# EAGLE design M_D_ext_power_old (EAGLE 9.6.2)
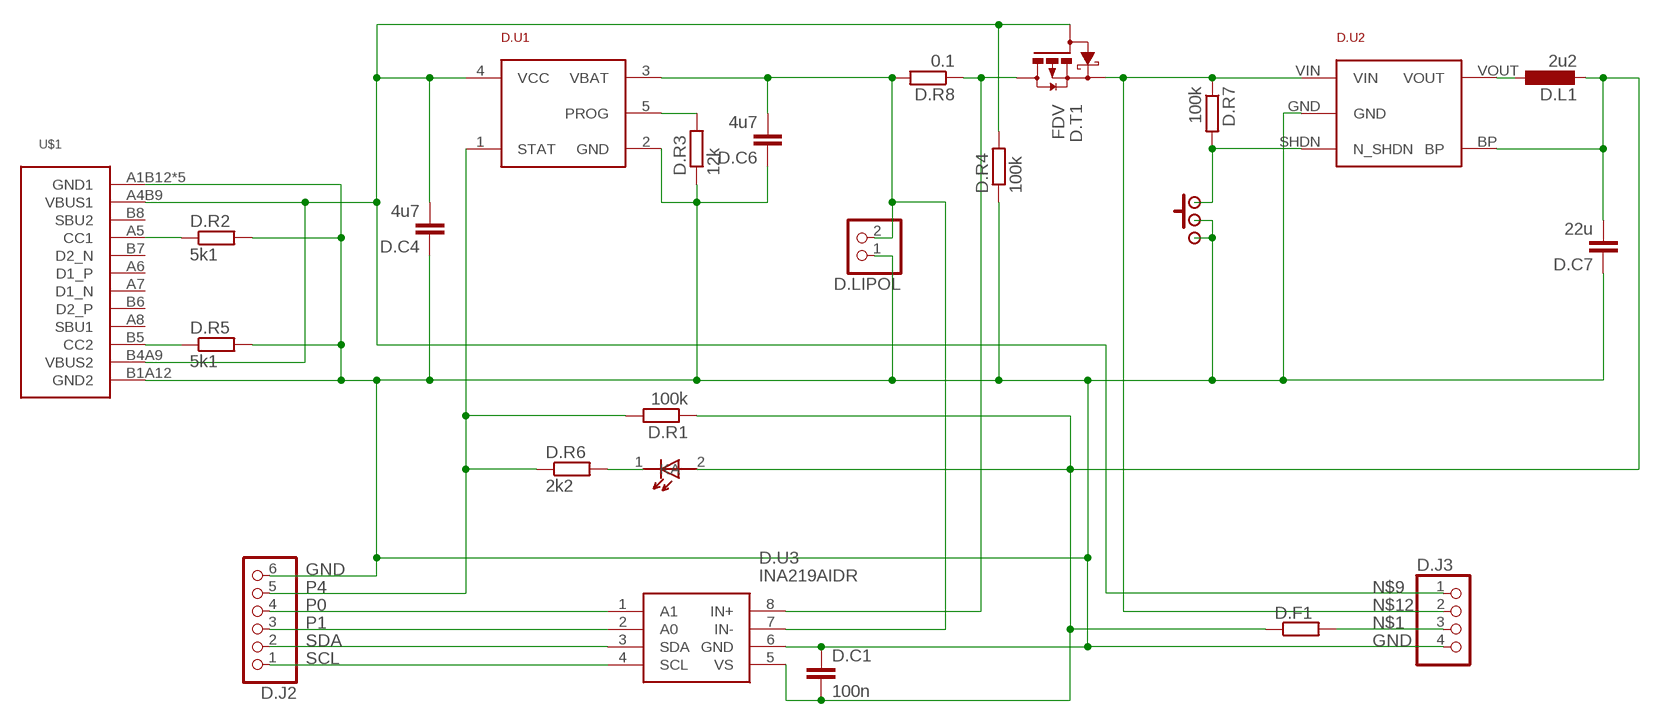
[diagram p0: schematic, sheet 1]

## Parts
D.C1  100n  C-EUC0603  [C0603]
D.C4  4u7  C-EUC0603  [C0603]
D.C6  4u7  C-EUC0603  [C0603]
D.C7  22u  C-EUC0805  [C0805]
D.D1  LED_1.8  [LED_1.8]
D.F1  R-EU_R0805  [R0805]
D.J2  PINHD-1X6  [1X06]
D.J3  PINHD-1X4  [1X04]
D.L1  2u2  L-EUL3230M  [L3230M]
D.LIPOL  PINHD-1X2  [1X02]
D.ON/OFF/RESET  SWITCH  [SWITCH]
D.R1  100k  R-EU_R0603  [R0603]
D.R2  5k1  R-EU_R0603  [R0603]
D.R3  12k  R-EU_R0603  [R0603]
D.R4  100k  R-EU_R0603  [R0603]
D.R5  5k1  R-EU_R0603  [R0603]
D.R6  2k2  R-EU_R0603  [R0603]
D.R7  100k  R-EU_R0603  [R0603]
D.R8  0.1  R-EU_R0805  [R0805]
D.T1  FDV  P-MOSFET-FDV304P  [SOT23]
D.U1  MCP  MCP73831  [SOT23-5]
D.U2  LM3671_3.3  STABILISER_APE8865  [SOT32-5]
D.U3  INA219AIDR  [SOIC127P600X175-8N]
U$1  USB-C  [USB-C]

## Nets
GND: D.C1.1 D.C4.1 D.C6.1 D.C7.1 D.J2.6 D.J3.4 D.LIPOL.1 D.ON/OFF/RESET.P$2 D.ON/OFF/RESET.P$3 D.ON/OFF/RESET.P$5 D.R2.2 D.R3.1 D.R4.1 D.R5.2 D.U1.2(GND) D.U2.GND D.U3.6(GND) U$1.A1B12(GND1) U$1.B1A12(GND2) U$1.SH1(GND1) U$1.SH2(GND1) U$1.SH3(GND1) U$1.SH4(GND1)
N$1: D.F1.2 D.J3.3
N$2: D.L1.1 D.U2.VOUT
N$3: D.D1.1(K) D.R6.2
N$4: D.R5.1 U$1.B5(CC2)
N$5: D.ON/OFF/RESET.P$1 D.ON/OFF/RESET.P$4 D.R7.2 D.U2.SHDN(N_SHDN)
N$6: D.R2.1 U$1.A5(CC1)
N$8: D.R8.1 D.T1.D D.U3.8(IN+)
N$9: D.C4.2 D.J3.1 D.R4.2 D.T1.G D.U1.4(VCC) U$1.A4B9(VBUS1) U$1.B4A9(VBUS2)
N$11: D.R3.2 D.U1.5(PROG)
N$12: D.J3.2 D.R7.1 D.T1.S D.U2.VIN
N$13: D.C6.2 D.LIPOL.2 D.R8.2 D.U1.3(VBAT) D.U3.7(IN-)
P0: D.J2.4 D.U3.1(A1)
P1: D.J2.3 D.U3.2(A0)
P4: D.J2.5 D.R1.2 D.R6.1 D.U1.1(STAT)
SCL: D.J2.1 D.U3.4(SCL)
SDA: D.J2.2 D.U3.3(SDA)
VDD: D.C1.2 D.C7.2 D.D1.2(A) D.F1.1 D.L1.2 D.R1.1 D.U2.BP D.U3.5(VS)
Unconnected: U$1.A6(D1_P) U$1.A7(D1_N) U$1.A8(SBU1) U$1.B6(D2_P) U$1.B7(D2_N) U$1.B8(SBU2)

## Library data of the parts
D.C1 D.C4 D.C6 D.C7 = rcl:C-EU: CAPACITOR, European symbol; SPICEPREFIX: C
D.D1 = hugo:LED_1.8
D.F1 D.R1-D.R8 = rcl:R-EU_: RESISTOR, European symbol; SPICEPREFIX: R
D.J2 = pinhead2:PINHD-1X6: PIN HEADER
D.J3 = pinhead2:PINHD-1X4: PIN HEADER
D.L1 = rcl:L-EU: INDUCTOR, European symbol; SPICEPREFIX: L
D.LIPOL = pinhead2:PINHD-1X2: PIN HEADER
D.ON/OFF/RESET = hugo:SWITCH
D.T1 = !stavebnice03:P-MOSFET-FDV304P
D.U1 = !stavebnice03:MCP73831
D.U2 = !stavebnice03:STABILISER_APE8865
D.U3 = SamacSys_Parts:INA219AIDR: 26-V, Bidirectional, Zero-Drift, High-Side, I2C Out Current/Power Monitor Source: Datasheet <http://www.ti.com/lit/gpn/ina219>; DESCRIPTION: 26-V, Bidirectional, Zero-Drift, High-Side, I2C Out Current/Power Monitor; HEIGHT: 1.75mm; MANUFACTURER_NAME: Texas Instruments; MANUFACTURER_PART_NUMBER: INA219AIDR; MOUSER_PART_NUMBER: 595-INA219AIDR; MOUSER_PRICE-STOCK: https://www.mouser.co.uk/ProductDetail/Texas-Instruments/INA219AIDR?qs=XGzIaZb%2FFYIE5YcOHTnKDA%3D%3D
U$1 = hugo:USB-C

## Board
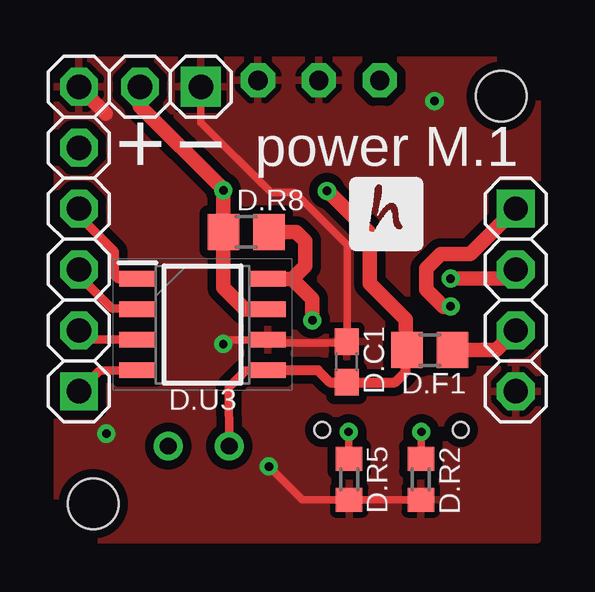
[diagram p1: board, top side]
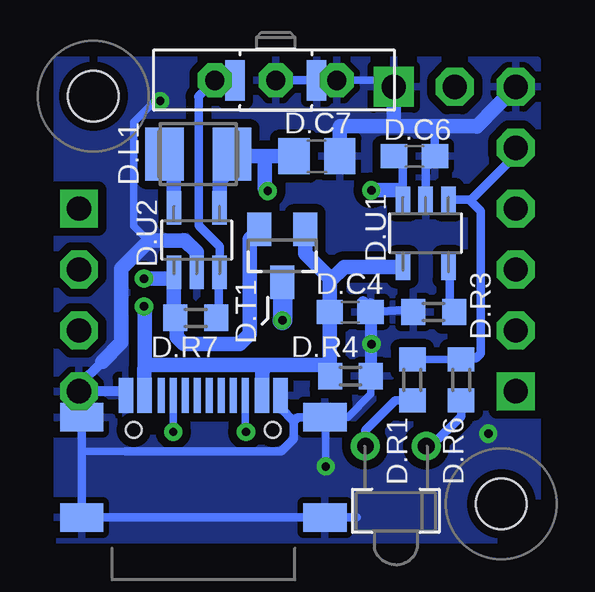
[diagram p2: board, bottom side, seen from below]

No outline drawn. Coordinates in mm, seen from the top.
Copper layers (1*16): Top 0.035mm / dielectric 1.5mm / Bottom 0.035mm
Design rules "default *": minimum track width 10mil, minimum drill 0.35mm, track to track 6mil, track to pad 6mil, pad to pad 6mil, via to via 10mil, smd to smd 10mil, copper to edge 15mil, drill to drill 15mil, minimum pad ring 10mil, minimum via ring 8mil, stop-mask expansion 4mil, vias tented up to drill 0mil, thermal gap 10mil
Holes 2.1 mm at 2,2 19,19

### Footprints (pad centres in the part's own frame; a part is rotated, then mirrored left to right if it is on the bottom)
C0603 = smd 1.1 x 1: 1 -0.85,0; 2 0.85,0
C0805 = smd 1.3 x 1.5: 1 -0.95,0; 2 0.95,0
LED_1.8 = drill 0.7: 1 -1.27,-0.4; 2 1.27,-0.4
R0805 = smd 1.3 x 1.5: 1 -0.95,0; 2 0.95,0
1X06 = drill 1.016 pad 1.575 square: 1 -6.35,0 | drill 1.016 pad 1.575 octagon: 2 -3.81,0; 3 -1.27,0; 4 1.27,0; 5 3.81,0; 6 6.35,0
1X04 = drill 1.016 pad 1.575 square: 1 -3.81,0 | drill 1.016 pad 1.575 octagon: 2 -1.27,0; 3 1.27,0; 4 3.81,0
L3230M = smd 1.6 x 2.2: 1 -1.4,0; 2 1.4,0
1X02 = drill 1.016 pad 1.676 square: 1 -1.27,0 | drill 1.016 pad 1.575 octagon: 2 1.27,0
SWITCH = drill 0.8 pad 1.422 octagon: P$1 -2.54,0; P$2 0,0; P$3 2.54,0 | smd 0.8 x 1.7: P$4 -1.7,0; P$5 1.7,0
R0603 = smd 1 x 1.1: 1 -0.85,0; 2 0.85,0
SOT23 = smd 1 x 1.4: D 0,1.1; G -0.95,-1.1; S 0.95,-1.1
SOT23-5 = smd 0.6 x 1.1: 1 -0.95,-1.45; 2 0,-1.45; 3 0.95,-1.45; 4 0.95,1.35; 5 -0.95,1.35
SOT32-5 = smd 0.6 x 1.4: BP 0.95,1.35; GND 0,-1.35; SHDN 0.95,-1.35; VIN -0.95,-1.35; VOUT -0.95,1.35
SOIC127P600X175-8N = smd 1.528 x 0.65: 1 -2.711,1.905; 2 -2.711,0.635; 3 -2.711,-0.635; 4 -2.711,-1.905; 5 2.711,-1.905; 6 2.711,-0.635; 7 2.711,0.635; 8 2.711,1.905
USB-C = smd 0.6 x 1.45: A1B12 -3.235,3.825; A4B9 -2.46,3.825; B1A12 3.215,3.825; B4A9 2.44,3.825 | smd 0.3 x 1.45: A5 -1.26,3.825; A6 -0.26,3.825; A7 0.24,3.825; A8 1.24,3.825; B5 1.74,3.825; B6 0.74,3.825; B7 -0.76,3.825; B8 -1.76,3.825 | smd 1.8 x 1.2: SH1 -5.08,2.91; SH2 -5.08,-1.27; SH3 5.06,-1.27; SH4 5.06,2.91 | hole 0.65: 2.88,2.38; -2.9,2.38

### Placement (x,y rotation side)
D.C1  12.55,7.92 270 top
D.C4  8.3,10 180 bottom
D.C6  5.62,16.49 180 bottom
D.C7  9.69,16.49 180 bottom
D.D1  6.4,4.01 180 bottom
D.F1  16.02,8.41 0 top
D.J2  1.4,13.04 90 top
D.J3  19.6,10.5 270 top
D.L1  14.63,16.59 0 bottom
D.LIPOL  5.21,19.39 180 top
D.ON/OFF/RESET  11.4,19.66 0 bottom
D.R1  5.71,7.17 90 bottom
D.R2  15.65,3.02 270 top
D.R3  4.82,10 0 bottom
D.R4  8.28,7.32 180 bottom
D.R5  12.66,3.02 270 top
D.R6  3.68,7.16 270 bottom
D.R7  14.73,9.75 0 bottom
D.R8  8.37,13.34 180 top
D.T1  11.13,12.34 180 bottom
D.U1  5.16,13.23 180 bottom
D.U2  14.69,13 0 bottom
D.U3  6.55,9.47 0 top
U$1  14.41,2.7 0 bottom

### Tracks (layer width: path | path; a pad name or v marks a point on that pad's centre or on a via)
GND  (via drill 0.35)
  Top 0.305: D.LIPOL.1 6.48,18.89 6.47,18.88 6.47,17.9 9.41,14.97 10.4,14.97 12.59,12.79 12.59,8.76 12.54,8.71 12.5,8.71 | D.U3.6 9.25,8.83 | 12.5,8.71 9.92,8.71 9.8,8.84 D.U3.6 | D.U3.6 7.6,8.84 v7.42,8.66 | D.C1.1 12.5,8.71 | D.R2.2 | D.R2.2 D.R5.2 10.7,2.17 v9.32,3.56
  Top 0.61: 2.52,18.27 1.41,19.39 D.J2.6
  Bottom 0.305: 17.68,4.2 19.49,4.2 19.49,4.19 | v16.21,18.8 16.44,18.8 17.32,17.92 17.32,13.58 16.7,12.96 | D.R4.1 7.43,6.58 8.4,5.61 U$1.SH4 9.32,5.58 v9.32,3.56 | D.ON/OFF/RESET.P$3 6.75,19.66 D.LIPOL.1
  Bottom 0.356: 6.48,17.96 D.LIPOL.1 | 5.61,10.08 D.R3.1 5.69,10.09 D.C4.1 | 10.65,5.45 10.65,4.71 11.16,4.2 17.68,4.2 | 10.65,5.45 11.2,6 U$1.B1A12 | 10.65,5.45 10.48,5.61 U$1.SH4 | U$1.SH1 19.49,4.19 U$1.SH2 U$1.SH3 8.03,1.43 | 4.77,17.75 D.C6.1 4.77,16.4 5.16,16.01 D.U1.2 | D.ON/OFF/RESET.P$3 D.ON/OFF/RESET.P$5 D.ON/OFF/RESET.P$2
  Bottom 0.406: 18.64,7.92 19.6,6.96 | D.J3.4 19.59,6.7 17.82,6.7 U$1.A1B12
  Bottom 0.508: D.C4.1 7.45,10.3 | D.C4.1 7.45,10.32 | 7.77,10.41 D.C4.1 | 7.43,8.66 | 7.43,8.66 v7.42,8.66 7.45,8.69 D.C4.1 | 7.43,8.66 D.R4.1
  Bottom 0.61: D.LIPOL.1 6.48,17.84 6.39,17.75 | 6.39,17.75 4.77,17.75 3.05,17.75 3.03,17.72 D.J2.6 | D.U2.GND 14.69,12.49 15.19,12.99 16.68,12.99 16.7,12.96 17.84,11.82 17.84,8.73 18.64,7.92 | 8.81,5.84 9.12,5.84 U$1.SH4 9.22,5.74 | 19.6,6.96 D.J3.4 19.6,5.72 U$1.SH1 | D.C7.1 8.74,17.72 8.71,17.75 6.39,17.75
  other vias: 2.54,4.93
  pour Top (isolate 0.356): 0.5,20.5 0.5,0.5 20.5,0.5 20.5,20.5
  pour Bottom (isolate 0.356): 0.5,20.5 20.5,20.5 20.5,0.5 0.5,0.5
N$1
  Top 0.61: D.F1.2 18.78,8.41 D.J3.3
N$2
  Bottom 0.61: D.U2.VOUT 15.64,15.81 16.03,16.2 D.L1.1
N$3
  Bottom 0.356: D.R6.2 3.43,6.06 | 3.35,6.31 D.R6.2 | D.R6.2 3.68,5.64 4.92,4.41 D.D1.1
N$4  (via drill 0.35)
  Top 0.305: D.R5.1 12.64,3.89 v12.64,5
  Bottom 0.305: U$1.B5 12.67,5.19 v12.64,5
N$5
  Bottom 0.356: D.R7.2 13.78,9.86 13.78,11.62 D.U2.SHDN 13.74,12.73 14.6,13.6 14.6,18.9 14.62,18.98 D.ON/OFF/RESET.P$1 D.ON/OFF/RESET.P$4
N$6  (via drill 0.35)
  Top 0.305: v15.67,5 15.67,3.9 D.R2.1
  Bottom 0.305: U$1.A5 v15.67,5
N$8  (via drill 0.35)
  Top 0.61: 11.12,9.75 v11.12,9.65 11.12,10.55 10.29,11.38 D.U3.8 10.29,11.38 10.83,11.91 10.83,12.96 10.45,13.34 D.R8.1
  Bottom 0.813: D.T1.D 11.11,11.22 11.11,9.67 v11.12,9.65
N$9  (via drill 0.35)
  Top 0.61: D.J3.1 17.71,12.43 16.48,12.43 15.87,11.81 15.87,10.93 16.59,10.2 16.86,10.2 v16.89,10.23
  Bottom 0.356: 9.15,11.28 D.C4.2
  Bottom 0.508: 11.95,6.51 11.95,7.52 11.95,7.72
  Bottom 0.61: 9.28,10.22 D.C4.2 | 10.18,13.57 D.T1.G 10.18,12.45 9.15,11.41 D.C4.2 | D.C4.2 9.18,10.07 | D.C4.2 9.15,7.34 D.R4.2 9.13,7.61 9.33,7.8 11.88,7.8 11.95,7.72 | v16.89,10.23 16.86,10.22 16.86,7.64 | U$1.B4A9 11.97,7.5 | 11.97,7.5 11.97,7.76 11.99,7.8 16.72,7.8 16.86,7.64 | U$1.A4B9 16.87,7.63 16.86,7.64 | 11.95,7.52 11.97,7.5 | D.U1.4 8.55,11.88 9.15,11.28
N$11
  Bottom 0.356: 3.97,10.23 D.R3.2 4.15,10.25 4.15,11.83 D.U1.5
N$12  (via drill 0.35)
  Top 0.61: v16.89,11.39 v16.9,11.4 19.23,11.4 D.J3.2
  Bottom 0.356: 15.9,11.39 D.U2.VIN
  Bottom 0.61: D.U2.VIN 15.64,9.82 D.R7.1 15.53,9.7 15.53,8.95 15.24,8.66 12.89,8.66 12.48,9.07 12.48,13.04 D.T1.S | v16.89,11.39 15.9,11.39
N$13  (via drill 0.35)
  Top 0.61: D.LIPOL.2 3.94,18.59 7.42,15.12 v7.42,15.07 D.R8.2 7.42,11.02 8.33,10.11 D.U3.7
  Bottom 0.305: D.C6.2 6.47,16.16
  Bottom 0.356: 6.43,16.45 D.C6.2 6.11,16.12 D.U1.3
  Bottom 0.61: v7.42,15.07 6.17,15.07 6.11,15.01 D.U1.3
P0
  Top 0.305: 3.01,11.38 D.U3.1 | D.J2.4 1.4,14.02
  Top 0.356: 3.01,11.38 2.9,11.49 2.9,12.52 1.4,14.02
P1
  Top 0.305: 1.4,11.43 D.J2.3 1.4,11.52
  Top 0.356: 1.4,11.52 2.77,10.14 3.81,10.14 D.U3.2
P4
  Bottom 0.305: 3.26,14.68 D.U1.1 | D.R1.2 D.R6.1
  Bottom 0.356: 4.21,14.97 D.U1.1 3.35,14.68 2.87,14.2 2.87,8.27 3.07,8.07 3.63,8.07 D.R6.1 | 3.26,14.68 1.4,16.55 D.J2.5
SCL
  Top 0.356: D.U3.4 2.28,7.57 D.J2.1
SDA
  Top 0.305: D.U3.3
  Top 0.356: D.U3.3 1.78,8.85 D.J2.2
VDD  (via drill 0.35)
  Top 0.305: 12.62,7.13 D.C1.2 12.77,7.28
  Top 0.356: D.C1.2 12.51,7.11 | D.D1.2 7.63,6.86 8.35,7.57 D.U3.5
  Top 0.406: D.U3.5 11.36,7.57 11.86,7.07 D.C1.2 14.58,7.07 15.02,7.51 15.02,9.68
  Top 0.61: v11.73,15.05 11.77,15.05 13.51,13.3 13.51,11.18 15.02,9.68 15.02,8.46 D.F1.1
  Bottom 0.356: D.D1.2 7.67,5.07 6.42,6.32 D.R1.1 | v11.73,15.05
  Bottom 0.61: D.U2.BP 13.74,15.5 13.23,16.01 D.L1.2 13.02,16.8 | 12.76,17.06 13.02,16.8 | D.C7.2 11.97,16.49 | 11.97,16.49 12.7,16.49 13.02,16.8 | v11.73,15.05 11.86,15.17 11.86,16.38 11.97,16.49

### Text on the board
tPlace: + | − | power M.1